# EAGLE design SCART CONECTOR (EAGLE 7.6.0)
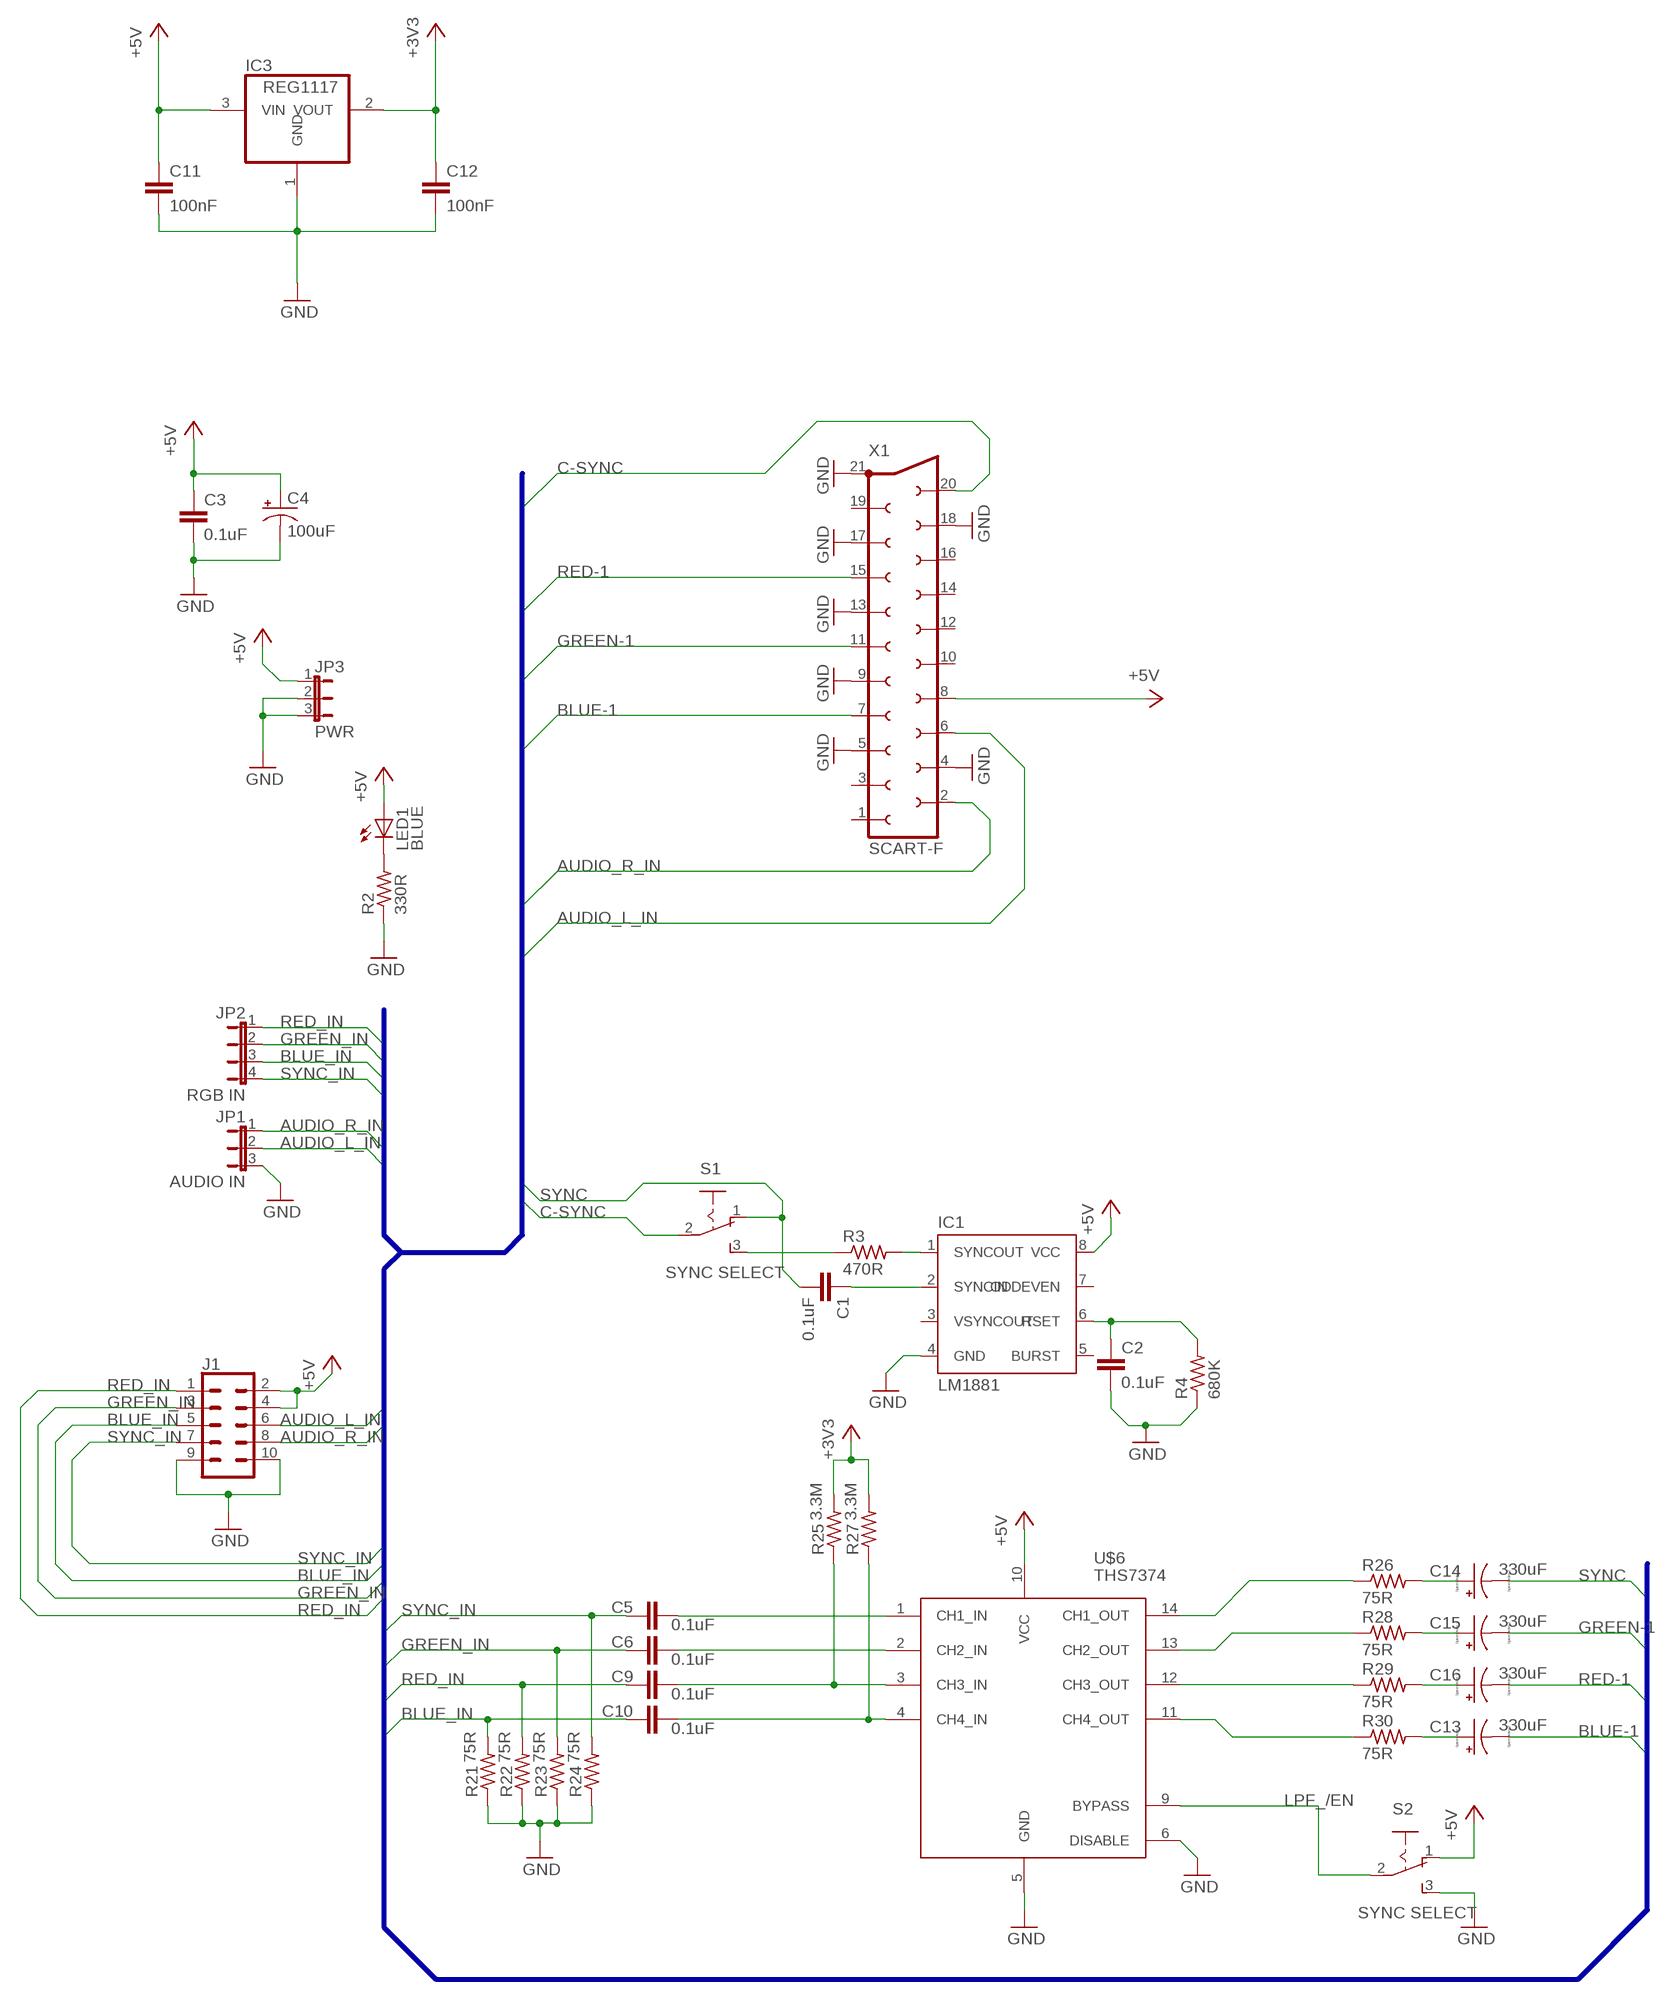
[diagram p0: schematic, sheet 1]

## Parts
C1  0.1uF  C7.5/3  [C7.5B3]
C2  0.1uF  C7.5/3  [C7.5B3]
C3  0.1uF  C7.5/3  [C7.5B3]
C4  100uF  CPOL-USE5-13  [E5-13]
C5  0.1uF  C-EU050-025X075  [C050-025X075]
C6  0.1uF  C-EU050-025X075  [C050-025X075]
C9  0.1uF  C-EU050-025X075  [C050-025X075]
C10  0.1uF  C-EU050-025X075  [C050-025X075]
C11  100nF  C-EU075-032X103  [C075-032X103]
C12  100nF  C-EU075-032X103  [C075-032X103]
C13  330uF  CPOL-USD/7343-31W  [D/7343-31W]
C14  330uF  CPOL-USD/7343-31W  [D/7343-31W]
C15  330uF  CPOL-USD/7343-31W  [D/7343-31W]
C16  330uF  CPOL-USD/7343-31W  [D/7343-31W]
IC1  LM1881  [DIL08]
IC3  REG1117  [SOT223]
J1  CONN_05X2SHD-NS  [2X5-SHROUDED-NS]
JP1  AUDIO IN  JP2E  [JP2]
JP2  RGB IN  JP4E  [JP4]
JP3  PWR  JP2E  [JP2]
LED1  BLUE  LED5MM  [LED5MM]
R2  330R  R-US_0204/7  [0204/7]
R3  470R  R-US_0204/7  [0204/7]
R4  680K  R-US_0204/7  [0204/7]
R21  75R  R-US_0204/2V  [0204V]
R22  75R  R-US_0204/2V  [0204V]
R23  75R  R-US_0204/2V  [0204V]
R24  75R  R-US_0204/2V  [0204V]
R25  3.3M  R-US_0204/7  [0204/7]
R26  75R  R-US_0204/7  [0204/7]
R27  3.3M  R-US_0204/7  [0204/7]
R28  75R  R-US_0204/7  [0204/7]
R29  75R  R-US_0204/7  [0204/7]
R30  75R  R-US_0204/7  [0204/7]
S1  SYNC SELECT  255SB  [255SB]
S2  SYNC SELECT  255SB  [255SB]
U$6  THS7374  [TSSOP-14]
X1  SCART-F  [SCART-F]

## Nets
+3V3: C12.1 IC3.2(VOUT) R25.2 R27.2
+5V [AMP]: C3.1 C4.+ C11.1 IC1.8(VCC) IC3.3(VIN) J1.2 J1.4 JP3.1 LED1.A S2.1(O) U$6.10(VCC) X1.8
AUDIO_L_IN [AMP]: J1.6 JP1.2 X1.6
AUDIO_R_IN [AMP]: J1.8 JP1.1 X1.2
BLUE-1 [AMP]: C13.- X1.7
BLUE_IN [AMP]: C10.1 J1.5 JP2.3 R21.2
C-SYNC [AMP]: S1.2(P) X1.20
GND [AMP]: C2.2 C3.2 C4.- C11.2 C12.2 IC1.4(GND) IC3.1(GND) J1.9 J1.10 JP1.3 JP3.2 JP3.3 R2.1 R4.1 R21.1 R22.1 R23.1 R24.1 S2.3(S) U$6.5(GND) U$6.6(DISABLE) X1.4 X1.5 X1.9 X1.13 X1.17 X1.18 X1.21
GREEN-1 [AMP]: C15.- X1.11
GREEN_IN [AMP]: C6.1 J1.3 JP2.2 R23.2
LPF_/EN: S2.2(P) U$6.9(BYPASS)
N$2 [AMP]: R3.1 S1.3(S)
N$3 [AMP]: IC1.1(SYNCOUT) R3.2
N$4: LED1.K(C) R2.2
N$5 [AMP]: C1.1 IC1.2(SYNCIN)
N$6 [AMP]: C2.1 IC1.6(RSET) R4.2
N$18 [AMP]: C6.2 U$6.2(CH2_IN)
N$19 [AMP]: C9.2 R25.1 U$6.3(CH3_IN)
N$20 [AMP]: C10.2 R27.1 U$6.4(CH4_IN)
N$21 [AMP]: C5.2 U$6.1(CH1_IN)
N$22 [AMP]: R26.1 U$6.14(CH1_OUT)
N$23 [AMP]: R28.1 U$6.13(CH2_OUT)
N$24 [AMP]: R29.1 U$6.12(CH3_OUT)
N$25 [AMP]: R30.1 U$6.11(CH4_OUT)
N$26: C13.+ R30.2
N$27: C16.+ R29.2
N$28: C15.+ R28.2
N$29: C14.+ R26.2
RED-1 [AMP]: C16.- X1.15
RED_IN [AMP]: C9.1 J1.1 JP2.1 R22.2
SYNC [AMP]: C1.2 C14.- S1.1(O)
SYNC_IN [AMP]: C5.1 J1.7 JP2.4 R24.2
Unconnected: IC1.3(VSYNCOUT) IC1.5(BURST) IC1.7(ODDEVEN) X1.1 X1.3 X1.10 X1.12 X1.14 X1.16 X1.19

## Buses
B$1

## Library data of the parts
C1-C3 = capacitor-wima:C: CAPACITOR naming: grid - package width
C4 = rcl:CPOL-US: POLARIZED CAPACITOR, American symbol
C5 C6 C9-C12 = rcl:C-EU: CAPACITOR, European symbol
C13-C16 = resistor:CPOL-US: POLARIZED CAPACITOR, American symbol
IC1 = lm1881:LM1881
IC3 = burr-brown:REG1117: 800mA and 1A Low Dropout (LDO) Positive Regulator 1.8V, 2.5V, 2.85V, 3.3V, 5V, and Adj; MPN: REG1117; OC_FARNELL: 1097566; OC_NEWARK: 14P6981
J1 = SparkFun-Connectors:CONN_05X2: Multi connection point. Often used as Generic Header-pin footprint for 0.1 inch spaced/style header connections For AVR SPI programming port, see special device with nice symbol: "AVR_SPI_PROG_5x2.dev" You can populate with any combo of single row headers, but if you'd like an exact match, check these: 2x5 AVR ICSP Male Header <https://www.sparkfun.com/products/778> (PRT-00778) 2x5 Pin Shrouded Header <https://www.sparkfun.com/products/8506> (PRT-08506) On any of the 0.1 inch spaced packages, you can populate with these: Break Away Headers - Straight <https://www.sparkfun.com/products/116> (PRT-00116) Break Away Male Headers - Right Angle <https://www.sparkfun.com/products/553> (PRT-00553) Female Headers <https://www.sparkfun.com/products/115> (PRT-00115) Break Away Headers - Machine Pin <https://www.sparkfun.com/products/117> (PRT-00117) Break Away Female Headers - Swiss Machine Pin <https://www.sparkfun.com/products/743> (PRT-00743) Special note: the shrouded connector mates well with our 5x2 ribbon cables: 2x5 Pin IDC Ribbon Cable <https://www.sparkfun.com/products/8535> (PRT-08535); PROD_ID: CONN-08671; SF_ID: PRT-08506
JP1 JP3 = jumper:JP2E: JUMPER
JP2 = jumper:JP4E: JUMPER
LED1 = led:LED: LED OSRAM: - CHIPLED LG R971, LG N971, LY N971, LG Q971, LY Q971, LO R971, LY R971 LH N974, LH R974 LS Q976, LO Q976, LY Q976 LO Q996 - Hyper CHIPLED LW Q18S LB Q993, LB Q99A, LB R99A - SideLED LS A670, LO A670, LY A670, LG A670, LP A670 LB A673, LV A673, LT A673, LW A673 LH A674 LY A675 LS A676, LA A676, LO A676, LY A676, LW A676 LS A679, LY A679, LG A679 - Hyper Micro SIDELED® LS Y876, LA Y876, LO Y876, LY Y876 LT Y87S - SmartLED LW L88C, LW L88S LB L89C, LB L89S, LG L890 LS L89K, LO L89K, LY L89K LS L896, LA L896, LO L896, LY L896 - TOPLED LS T670, LO T670, LY T670, LG T670, LP T670 LSG T670, LSP T670, LSY T670, LOP T670, LYG T670 LG T671, LOG T671, LSG T671 LB T673, LV T673, LT T673, LW T673 LH T674 LS T676, LA T676, LO T676, LY T676, LB T676, LH T676, LSB T676, LW T676 LB T67C, LV T67C, LT T67C, LS T67K, LO T67K, LY T67K, LW E67C LS E67B, LA E67B, LO E67B, LY E67B, LB E67C, LV E67C, LT E67C LW T67C LS T679, LY T679, LG T679 LS T770, LO T770, LY T770, LG T770, LP T770 LB T773, LV T773, LT T773, LW T773 LH T774 LS E675, LA E675, LY E675, LS T675 LS T776, LA T776, LO T776, LY T776, LB T776 LHGB T686 LT T68C, LB T68C - Hyper Mini TOPLED® LB M676 - Mini TOPLED Santana® LG M470 LS M47K, LO M47K, LY M47K Source: http://www.osram.convergy.de LUXEON: - LUMILED® LXK2-PW12-R00, LXK2-PW12-S00, LXK2-PW14-U00, LXK2-PW14-V00 LXK2-PM12-R00, LXK2-PM12-S00, LXK2-PM14-U00 LXK2-PE12-Q00, LXK2-PE12-R00, LXK2-PE12-S00, LXK2-PE14-T00, LXK2-PE14-U00 LXK2-PB12-K00, LXK2-PB12-L00, LXK2-PB12-M00, LXK2-PB14-N00, LXK2-PB14-P00, LXK2-PB14-Q00 LXK2-PR12-L00, LXK2-PR12-M00, LXK2-PR14-Q00, LXK2-PR14-R00 LXK2-PD12-Q00, LXK2-PD12-R00, LXK2-PD12-S00 LXK2-PH12-R00, LXK2-PH12-S00 LXK2-PL12-P00, LXK2-PL12-Q00, LXK2-PL12-R00 Source: www.luxeon.com KINGBRIGHT: KA-3528ASYC Source: www.kingbright.com
R2-R4 R21-R30 = rcl:R-US_: RESISTOR, American symbol
S1 S2 = switch:255SB: SLIDING SWITCH Distributor Buerklin, 11G810
U$6 = THS7374:THS7374
X1 = con-hirschmann:SCART-F: TV SCART CONNECTOR; OC_FARNELL: unknown; OC_NEWARK: unknown

## Net classes
0 default: width 0.406 mm
1 AMP: width 0.381 mm

## Board
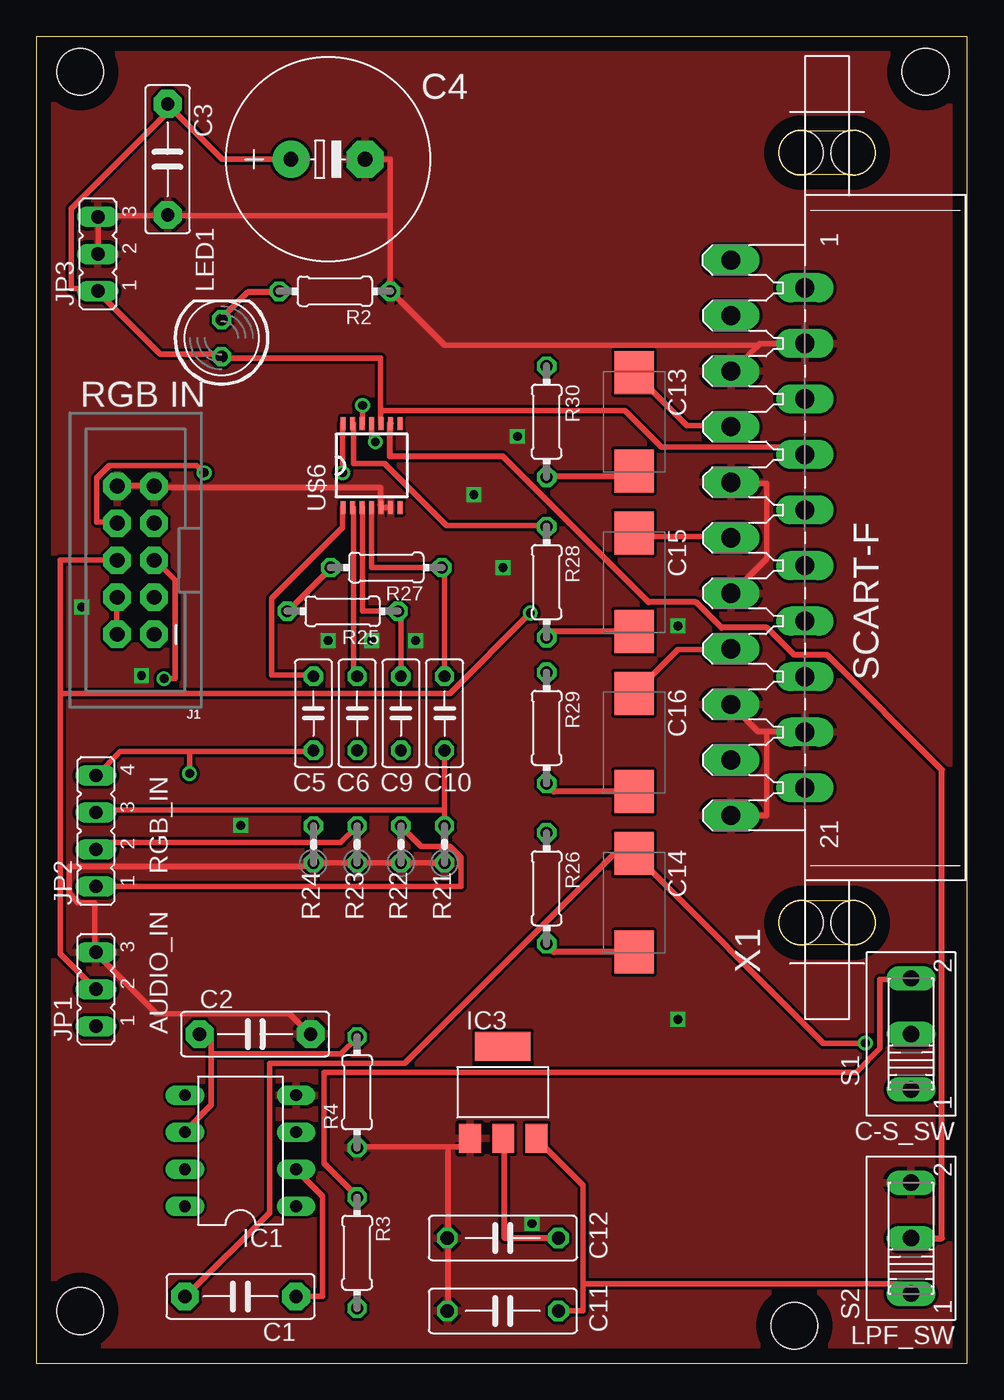
[diagram p1: board, top side]
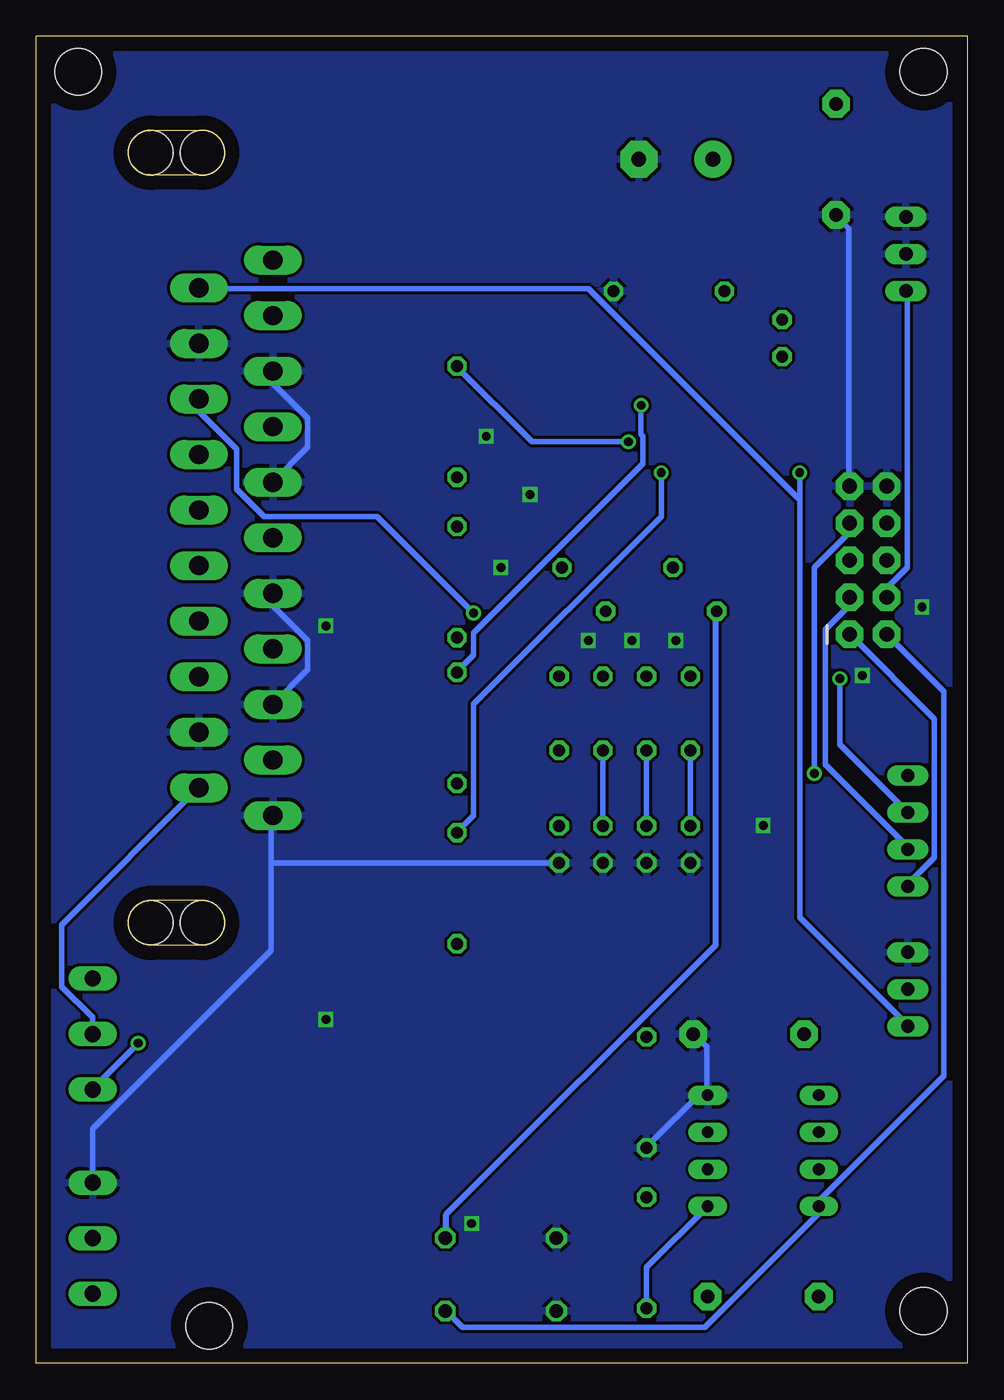
[diagram p2: board, bottom side, seen from below]

Size 63.86 x 91 mm. Coordinates in mm from the lower left corner, seen from the top.
Outline: 0,0 63.86,0 63.86,91 0,91 0,0
Copper layers (1*16): Top 0.035mm / dielectric 1.5mm / Bottom 0.035mm
Design rules "default": minimum track width 10mil, minimum drill 24mil, track to track 8mil, track to pad 8mil, pad to pad 8mil, via to via 8mil, smd to smd 8mil, copper to edge 40mil, drill to drill 8mil, minimum pad ring 10mil, minimum via ring 8mil, stop-mask expansion 4mil, vias tented up to drill 0mil, thermal gap 10mil
Holes 3.2 mm at 52,2.57 3,3.57 3,88.57 61,88.57

### Footprints (pad centres in the part's own frame; a part is rotated, then mirrored left to right if it is on the bottom)
C7.5B3 = drill 0.914 pad 1.905 octagon: 1 -3.81,0; 2 3.81,0
E5-13 = drill 1.016 pad 2.54: + -2.54,0 | drill 1.016 pad 2.54 octagon: - 2.54,0
C050-025X075 = drill 0.813 octagon: 1 -2.54,0; 2 2.54,0
C075-032X103 = drill 0.914 octagon: 1 -3.81,0; 2 3.81,0
D/7343-31W = smd 2.95 x 2.7: + 3.375,0; - -3.375,0
DIL08 = drill 0.813 long: 1 -3.81,-3.81; 2 -1.27,-3.81; 3 1.27,-3.81; 4 3.81,-3.81; 5 3.81,3.81; 6 1.27,3.81; 7 -1.27,3.81; 8 -3.81,3.81
SOT223 = smd 1.499 x 2.007: 1 -2.261,-3.15; 2 0.025,-3.15; 3 2.311,-3.15 | smd 3.81 x 2.007: 4 0,3.15
2X5-SHROUDED-NS = drill 1.016 pad 1.88 octagon: 1 -1.27,5.08; 2 1.27,5.08; 3 -1.27,2.54; 4 1.27,2.54; 5 -1.27,0; 6 1.27,0; 7 -1.27,-2.54; 8 1.27,-2.54; 9 -1.27,-5.08; 10 1.27,-5.08
JP2 = drill 0.914 long: 1 -2.54,0; 2 0,0; 3 2.54,0
JP4 = drill 0.914 long: 1 -3.81,0; 2 -1.27,0; 3 1.27,0; 4 3.81,0
LED5MM = drill 0.813 octagon: A -1.27,0; K 1.27,0
0204/7 = drill 0.813 octagon: 1 -3.81,0; 2 3.81,0
0204V = drill 0.813 octagon: 1 -1.27,0; 2 1.27,0
255SB = drill 1.118 long: 1 -3.81,0; 2 0,0; 3 3.81,0
TSSOP-14 = smd 0.9 x 0.35: 1 -2.875,1.95; 2 -2.875,1.3; 3 -2.875,0.65; 4 -2.875,0; 5 -2.875,-0.65; 6 -2.875,-1.3; 7 -2.875,-1.95; 8 2.875,-1.95; 9 2.875,-1.3; 10 2.875,-0.65; 11 2.875,0; 12 2.875,0.65; 13 2.875,1.3; 14 2.875,1.95
SCART-F = drill 1.321 long: 1 19.05,5.08; 2 17.145,0; 3 15.24,5.08; 4 13.335,0; 5 11.43,5.08; 6 9.525,0; 7 7.62,5.08; 8 5.715,0; 9 3.81,5.08; 10 1.905,0; 11 0,5.08; 12 -1.905,0; 13 -3.81,5.08; 14 -5.715,0; 15 -7.62,5.08; 16 -9.525,0; 17 -11.43,5.08; 18 -13.335,0; 19 -15.24,5.08; 20 -17.145,0; 21 -19.05,5.08 | hole 3.023: 26.416,0.254; 26.416,-3.302; -26.416,0.254; -26.416,-3.302

### Placement (x,y rotation side)
C1  14,4.57 180 top
C2  15,22.57 0 top
C3  9,82.57 270 top
C4  20,82.57 0 top
C5  19,44.57 90 top
C6  22,44.57 90 top
C9  25,44.57 90 top
C10  28,44.57 90 top
C11  32,3.57 180 top
C12  32,8.57 180 top
C13  41,64.57 270 top
C14  41,31.57 270 top
C15  41,53.57 270 top
C16  41,42.57 270 top
IC1  14,14.57 90 top
IC3  32,18.57 0 top
J1  6.8,55.07 180 top
JP1  4.08,25.64 90 top
JP2  4.08,36.5 90 top
JP3  4.21,76.08 90 top
LED1  12.7,70.31 90 top
R2  20.47,73.52 180 top
R3  22,7.57 270 top
R4  22,18.57 90 top
R21  28,35.57 90 top
R22  25,35.57 90 top
R23  22,35.57 90 top
R24  19,35.57 90 top
R25  21,51.57 180 top
R26  35,32.57 270 top
R27  24,54.57 180 top
R28  35,53.57 270 top
R29  35,43.57 270 top
R30  35,64.57 270 top
S1  60,22.57 90 top
S2  60,8.57 90 top
U$6  23,61.57 90 top
X1  52.72,56.61 90 top

### Tracks (layer width: path | path; a pad name or v marks a point on that pad's centre or on a via)
+3V3
  Top 0.406: R25.2 17.25,51.57 20.25,54.57 R27.2 | C12.1 32.12,8.57 32.12,15.32 IC3.2
  Bottom 0.406: R25.2 17.25,51.57 17.25,28.7 35.75,10.2 35.75,8.57 C12.1
+5V
  Top 0.381: 37.5,5.45 37.5,3.57 C11.1 | 37.5,5.45 37.5,12.2 34.38,15.32 IC3.3 | 37.5,5.45 59.38,5.45 60,4.82 S2.1 | C4.+ 12.75,82.57 9,86.32 C3.1 9.12,85.94 2.38,79.19 2.38,73.69 4.12,73.69 JP3.1 4.25,73.44 8.5,69.19 12.62,69.19 LED1.A 12.75,68.94 23.62,68.94 23.62,65.32 | J1.2 5.5,50.07 5.5,52.45 J1.4 | 23.62,65.32 23.62,64.44 U$6.10 | 23.62,65.32 40.38,65.32 42.88,62.82 52.25,62.82 52.62,62.45 X1.8
  Bottom 0.381: C11.1 35.75,3.57 34.62,2.44 18,2.44 10.25,10.2 10.25,10.7 IC1.8 10.12,10.95 10.12,11.2 1.62,19.7 1.62,46.07 5.5,49.95 J1.2 | J1.4 5.5,52.57 5.5,53.2 4.12,54.57 4.12,73.44 JP3.1
AUDIO_L_IN  (via drill 0.61)
  Top 0.381: 1.62,45.95 1.62,55.07 J1.6 | 1.62,45.95 1.62,28.07 4,25.7 JP1.2 | v33.88,51.45 28.38,45.95 1.62,45.95
  Bottom 0.381: v33.88,51.45 40.5,58.07 48.25,58.07 50.12,59.95 50.12,62.7 52.62,65.19 52.62,66.07 X1.6
AUDIO_R_IN  (via drill 0.61)
  Top 0.381: v11.5,61.07 11,61.57 5,61.57 4.12,60.7 4.12,57.7 5.5,57.7 J1.8
  Bottom 0.381: v11.5,61.07 11.5,59.32 | 11.5,59.32 11.5,30.57 4.12,23.2 JP1.1 | X1.2 52.62,73.69 26,73.69 11.62,59.32 11.5,59.32
BLUE-1
  Top 0.381: C13.- 44.62,64.32 47.62,64.32 X1.7
BLUE_IN  (via drill 0.61)
  Top 0.381: C10.1 28,37.95 | 28,37.95 R21.2 | 28,37.95 4.25,37.95 4.12,37.82 JP2.3 | v8.75,46.95 9.5,46.95 9.5,53.7 8.12,55.07 J1.5
  Bottom 0.381: v8.75,46.95 8.75,42.45 4.12,37.82 JP2.3
C-SYNC
  Bottom 0.381: S1.2 60,23.7 62.12,25.82 62.12,30.07 52.75,39.45 X1.20
GND  (via drill 0.61)
  Top 0.381: C11.2 28.25,3.57 28.25,8.57 C12.2 28.25,8.7 28.25,14.82 | 28.25,14.82 22,14.82 R4.1 | 28.25,14.82 29.12,14.82 29.62,15.32 IC3.1 | C2.2 18.75,22.57 17.38,23.95 8.25,23.95 4.12,28.07 JP1.3 4,28.32 4,31.57 2.88,31.57 2.25,32.2 2.25,34.07 18.75,34.07 18.88,34.2 R24.1 19,34.32 22,34.32 R23.1 22.12,34.32 25,34.32 R22.1 25.12,34.32 28,34.32 R21.1 | U$6.6 U$6.5 23.62,58.82 23.62,60.07 8.12,60.07 J1.9 8,60.2 5.62,60.2 J1.10 | JP3.2 4.25,76.19 4.25,78.57 JP3.3 4.38,78.69 9,78.69 C3.2 9.12,78.69 24.25,78.69 | 24.25,78.69 24.25,82.57 C4.- | 24.25,78.69 24.25,73.57 R2.1 24.38,73.44 28,69.82 49.25,69.82 49.38,69.69 | 49.38,69.69 49.62,69.94 X1.4 | 49.38,69.69 47.75,68.07 X1.5 | X1.13 47.75,52.82 50.12,55.2 50.12,60.32 47.75,60.32 X1.9 | X1.17 49.5,43.32 50.12,43.32 | 50.12,43.32 52.62,43.32 X1.18 | 50.12,43.32 50.12,37.57 47.75,37.57 X1.21
  Bottom 0.381: C2.2 18.75,22.57 17.88,21.7 17.88,18.45 IC1.4 18,18.82 22,14.82 R4.1 | J1.9 8.12,60.2 8.12,77.82 9,78.69 C3.2 | X1.5 47.62,67.94 47.62,67.19 45.25,64.82 45.25,62.82 47.62,60.45 X1.9 | S2.3 60,16.07 47.75,28.32 47.75,34.32 | 47.75,34.32 47.75,37.45 X1.21 | 47.75,34.32 28,34.32 R21.1 | X1.17 45.25,47.57 45.25,49.57 47.62,51.95 47.62,52.7 X1.13
  other vias: 3.1,51.87 7.2,47.17 14,36.87 44,23.57 44,50.57 32,54.57 26,49.57 23,49.57 20,49.57 30,59.57 33,63.57 34,9.57
  pour Bottom: 0,90.57 64,90.57 64,-0.43 0,-0.43
  pour Top: 0,90.57 64,90.57 64,-0.43 0,-0.43
GREEN-1
  Top 0.381: C15.- 41.25,56.7 47.62,56.7 X1.11
GREEN_IN
  Top 0.381: JP2.2 4.12,35.32 4.5,35.7 20.88,35.7 22,36.82 R23.2
  Bottom 0.381: C6.1 R23.2 | J1.3 8.12,52.45 8.12,51.95 9.75,50.32 9.75,41.07 4,35.32 JP2.2
LPF_/EN
  Top 0.406: S2.2 62.12,8.57 62.12,40.7 54.25,48.57 52,48.57 50.12,50.45 47,50.45 45.25,52.2 42,52.2 32,62.2 24.25,62.2 24.25,64.44 U$6.9
N$2
  Top 0.381: R3.1 22,11.45 19.75,13.7 19.75,19.95 56.25,19.95 57.88,21.57 57.88,26.32 60,26.32 S1.3
N$3
  Bottom 0.381: R3.2 22,6.57 IC1.1
N$4
  Top 0.406: LED1.K 12.75,71.69 14.5,73.44 16.62,73.44 R2.2
N$5
  Top 0.381: C1.1 19.62,4.57 19.62,11.45 17.88,13.2 IC1.2
N$6
  Top 0.381: 12,21.2 12,22.57 C2.1 | 12,21.2 12,17.7 10.25,15.95 IC1.6 | 12,21.2 20.88,21.2 22,22.32 R4.2
N$18
  Top 0.381: U$6.2 21.75,58.7 21.75,47.2 22,47.2 C6.2
N$19
  Top 0.381: U$6.3 22.38,58.7 22.38,51.57 R25.1 24.88,51.45 25,51.45 C9.2
N$20
  Top 0.381: U$6.4 23,54.57 R27.1 27.88,54.45 28,54.45 C10.2
N$21
  Top 0.381: U$6.1 21,58.7 21,57.32 16.12,52.45 16.12,47.2 19,47.2 C5.2
N$22  (via drill 0.61)
  Top 0.381: v21,61.07 21,64.44 U$6.14
  Bottom 0.381: v21,61.07 21,58.07 33.88,45.2 33.88,37.57 35,36.45 R26.1
N$23
  Top 0.381: U$6.13 21.75,64.44 21.75,61.7 23.88,61.7 28.12,57.45 35,57.45 R28.1
N$24  (via drill 0.61)
  Top 0.381: v22.38,65.69 22.38,64.44 U$6.12
  Bottom 0.381: v22.38,65.69 22.38,63.7 22.25,63.57 22.25,61.7 33.88,50.07 33.88,48.57 35,47.45 R29.1
N$25  (via drill 0.61)
  Top 0.381: U$6.11 23,63.2 v23.25,63.2
  Bottom 0.381: v23.25,63.2 29.88,63.2 35,68.32 R30.1
N$26
  Top 0.406: 41,60.82 C13.+ 40.88,60.82 35.12,60.82 R30.2 35,60.82
N$27
  Top 0.406: C16.+ 35.5,39.2 35,39.7 R29.2
N$28
  Top 0.406: C15.+ 35.38,50.2 35,49.82 R28.2
N$29
  Top 0.406: C14.+ 35.5,28.2 35,28.7 R26.2
RED-1
  Top 0.381: C16.- 44,48.95 47.62,48.95 X1.15
RED_IN
  Top 0.381: R22.2 25,36.82 26.38,35.45 28.38,35.45 29.12,34.7 29.12,32.7 4.12,32.7 JP2.1
  Bottom 0.381: C9.1 R22.2 | JP2.1 4,32.7 4,32.95 2.25,34.7 2.25,44.2 8,49.95 J1.1
SYNC  (via drill 0.61)
  Top 0.381: v56.88,21.95 54,21.95 C14.- 40.88,34.82 39.5,34.82 25.25,20.57 16,20.57 16,10.32 10.25,4.57 C1.2
  Bottom 0.381: v56.88,21.95 60,18.82 S1.1
SYNC_IN  (via drill 0.61)
  Top 0.381: 10.5,41.95 19,41.95 C5.1 | 10.5,41.95 5.75,41.95 4.12,40.32 JP2.4 | 10.5,41.95 v10.5,40.45
  Bottom 0.381: C5.1 R24.2 | v10.5,40.45 10.5,54.57 8.12,56.95 8.12,57.57 J1.7

### Text on the board
tPlace: RGB IN | RGB_IN | AUDIO_IN | C-S_SW | LPF_SW